# EAGLE design Group_03 (EAGLE 9.6.2)

## Sheet 1 of 2
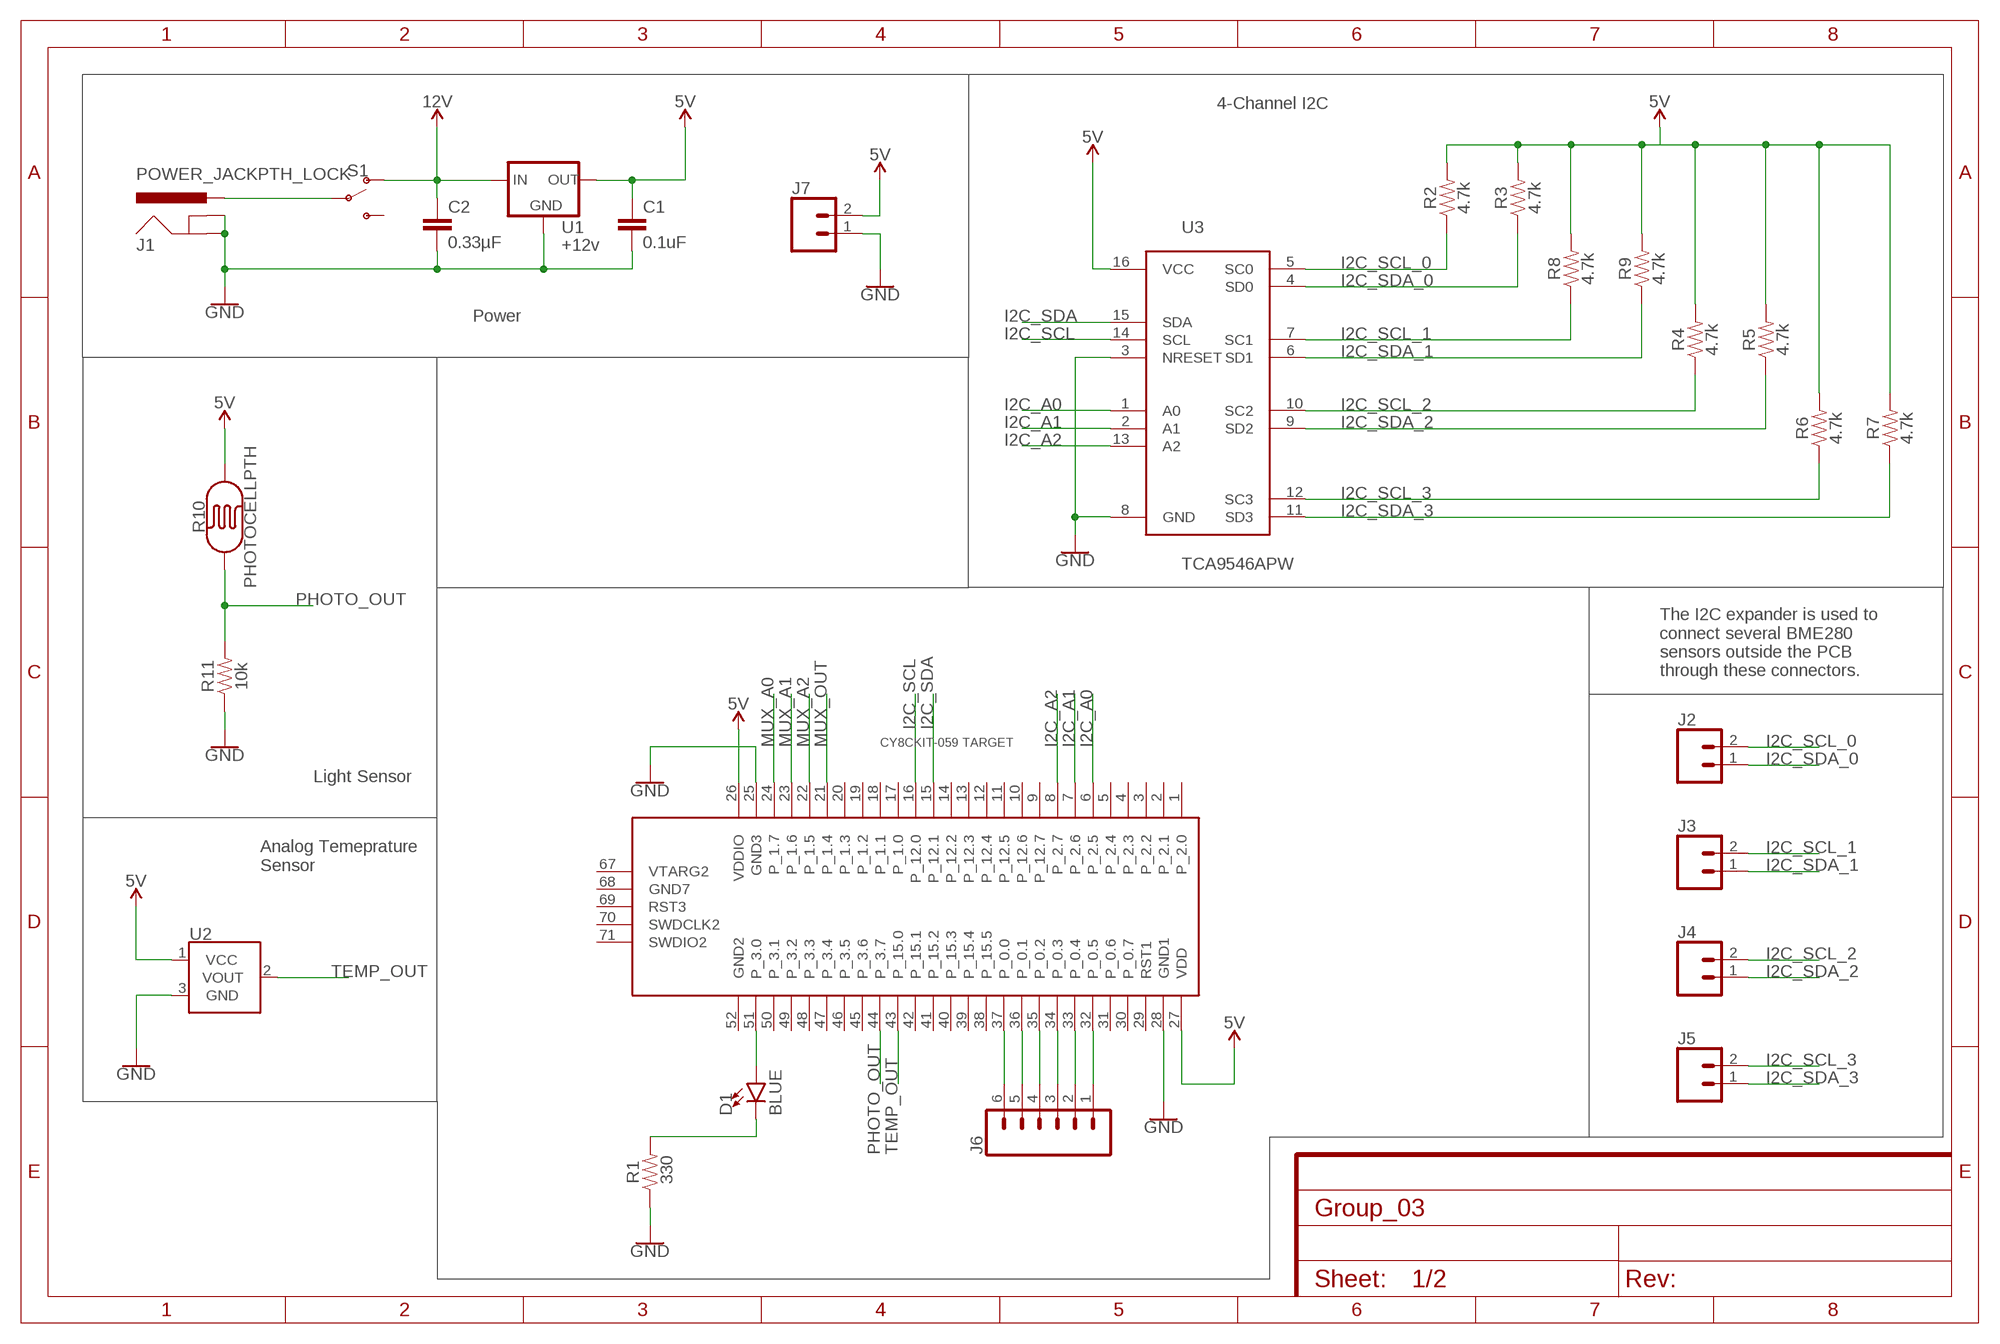
[diagram p0: schematic, sheet 1]

### Parts
C1  0.1uF  0.1UF-KIT-EZ-50V-20%  [CAP-PTH-SMALL-KIT]
C2  0.33µF  0.33UF/330NF-0805-50V-10%  [0805]
D1  BLUE  LED-BLUE1206  [LED-1206]
J1  POWER_JACKPTH_LOCK  [POWER_JACK_PTH_LOCK]
J2  CONN_02  [1X02]
J3  CONN_02  [1X02]
J4  CONN_02  [1X02]
J5  CONN_02  [1X02]
J6  CONN_06LOCK  [1X06_LOCK]
J7  CONN_02  [1X02]
R1  330  RESISTORAXIAL-0.3  [AXIAL-0.3]
R2  4.7k  4.7KOHM-0603-1/10W-1%  [0603]
R3  4.7k  4.7KOHM-0603-1/10W-1%  [0603]
R4  4.7k  4.7KOHM-0603-1/10W-1%  [0603]
R5  4.7k  4.7KOHM-0603-1/10W-1%  [0603]
R6  4.7k  4.7KOHM-0603-1/10W-1%  [0603]
R7  4.7k  4.7KOHM-0603-1/10W-1%  [0603]
R8  4.7k  4.7KOHM-0603-1/10W-1%  [0603]
R9  4.7k  4.7KOHM-0603-1/10W-1%  [0603]
R10  PHOTOCELLPTH  [PHOTOCELL]
R11  10k  10KOHM-0603-1/10W-1%  [0603]
S1  SWITCH-SPDT-PTH-11.6X4.0MM  [SWITCH_SPDT_PTH_11.6X4.0MM]
U1  +12v  V_REG_78XX7812  [TO-252]
U2  TMP36GT9  [TO-92]
U3  TCA9546APW  [TSSOP16]
U$1  CY8CKIT-059_TARGET  [CY8CKIT-059_TARGET]

### Nets
5V: C1.1 J7.2 R2.2 R3.2 R4.2 R5.2 R6.2 R7.2 R8.2 R9.2 R10.2 U1.2(OUT) U2.1(VCC) U3.16(VCC) U$1.26(VDDIO) U$1.27(VDD) ; also sheet 2
12V: C2.1 S1.1(O) U1.1(IN)
GND: C1.2 C2.2 J1.GND J1.GNDBREAK J7.1 R1.P$1 R11.1 U1.3(GND) U2.3(GND) U3.3(NRESET) U3.8(GND) U$1.25(GND3) U$1.28(GND1) ; also sheet 2
I2C_A0: U3.1(A0) U$1.6(P_2.5)
I2C_A1: U3.2(A1) U$1.7(P_2.6)
I2C_A2: U3.13(A2) U$1.8(P_2.7)
I2C_SCL: U3.14(SCL) U$1.16(P_12.0)
I2C_SCL_0: J2.2 R2.1 U3.5(SC0)
I2C_SCL_1: J3.2 R8.1 U3.7(SC1)
I2C_SCL_2: J4.2 R4.1 U3.10(SC2)
I2C_SCL_3: J5.2 R6.1 U3.12(SC3)
I2C_SDA: U3.15(SDA) U$1.15(P_12.1)
I2C_SDA_0: J2.1 R3.1 U3.4(SD0)
I2C_SDA_1: J3.1 R9.1 U3.6(SD1)
I2C_SDA_2: J4.1 R5.1 U3.9(SD2)
I2C_SDA_3: J5.1 R7.1 U3.11(SD3)
MUX_A0: U$1.24(P_1.7) ; also sheet 2
MUX_A1: U$1.23(P_1.6) ; also sheet 2
MUX_A2: U$1.22(P_1.5) ; also sheet 2
MUX_OUT: U$1.21(P_1.4) ; also sheet 2
N$1: J1.PWR S1.2(P)
N$3: J6.1 U$1.32(P_0.5)
N$4: J6.2 U$1.33(P_0.4)
N$5: J6.3 U$1.34(P_0.3)
N$6: J6.4 U$1.35(P_0.2)
N$7: J6.5 U$1.36(P_0.1)
N$8: J6.6 U$1.37(P_0.0)
N$9: D1.A U$1.51(P_3.0)
N$11: D1.C R1.P$2
PHOTO_OUT: R10.1 R11.2 U$1.44(P_3.7)
TEMP_OUT: U2.2(VOUT) U$1.43(P_15.0)
Unconnected: S1.3(S) U$1.1(P_2.0) U$1.2(P_2.1) U$1.3(P_2.2) U$1.4(P_2.3) U$1.5(P_2.4) U$1.9(P_12.7) U$1.10(P_12.6) U$1.11(P_12.5) U$1.12(P_12.4) U$1.13(P_12.3) U$1.14(P_12.2) U$1.17(P_1.0) U$1.18(P_1.1) U$1.19(P_1.2) U$1.20(P_1.3) U$1.29(RST1) U$1.30(P_0.7) U$1.31(P_0.6) U$1.38(P_15.5) U$1.39(P_15.4) U$1.40(P_15.3) U$1.41(P_15.2) U$1.42(P_15.1) U$1.45(P_3.6) U$1.46(P_3.5) U$1.47(P_3.4) U$1.48(P_3.3) U$1.49(P_3.2) U$1.50(P_3.1) U$1.52(GND2) U$1.67(VTARG2) U$1.68(GND7) U$1.69(RST3) U$1.70(SWDCLK2) U$1.71(SWDIO2)

### Notes on the sheet
- 4-Channel I2C
- Power
- The I2C expander is used to
  connect several BME280
  sensors outside the PCB
  through these connectors.
- Light Sensor
- Analog Temeprature 
  Sensor

## Sheet 2 of 2
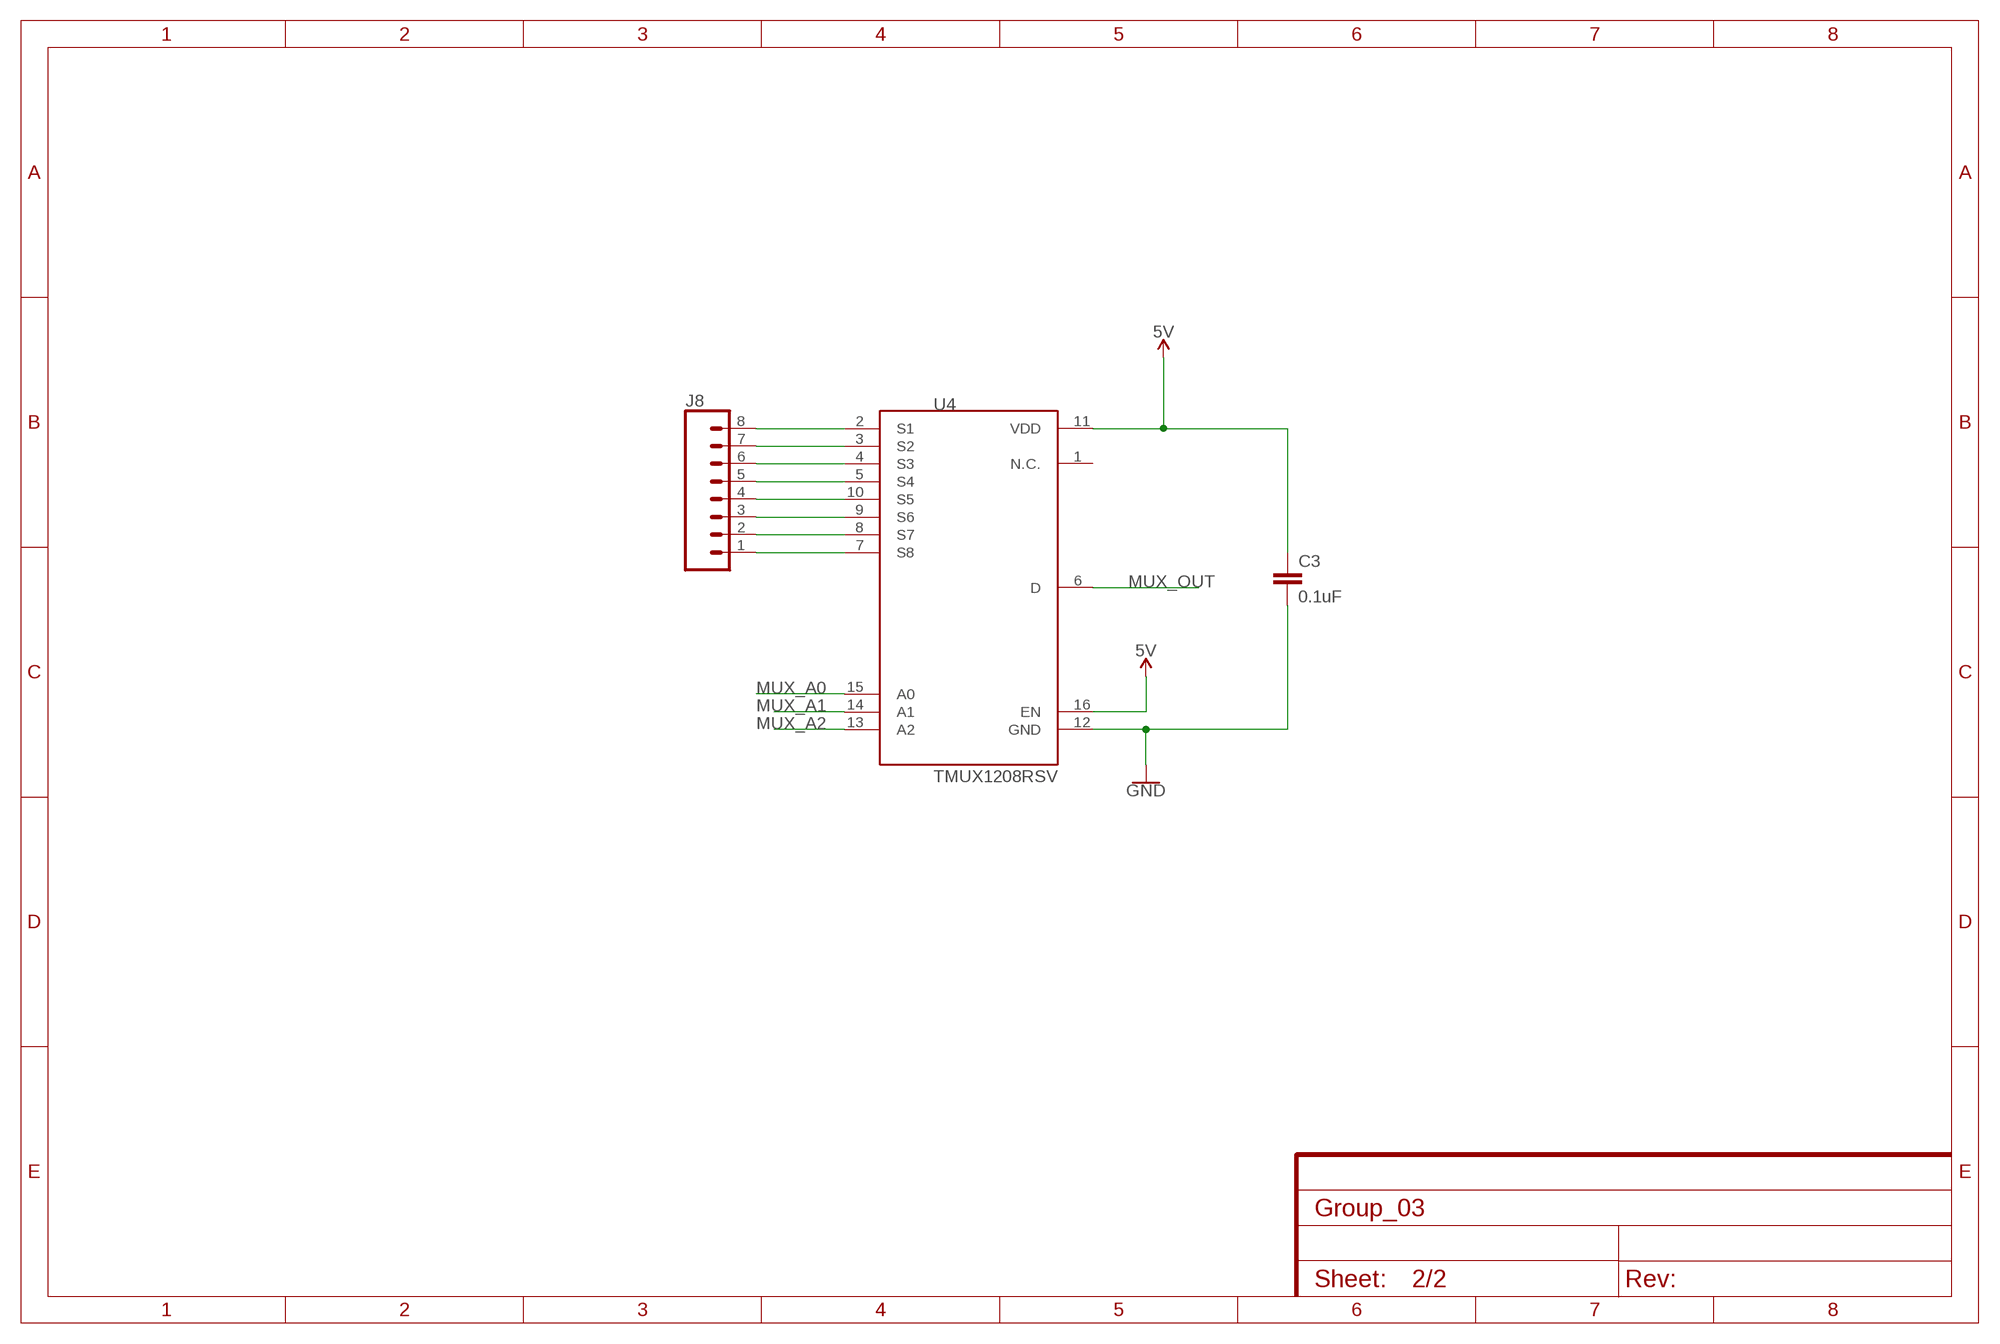
[diagram p1: schematic, sheet 2]

### Parts
C3  0.1uF  0.1UF-KIT-EZ-50V-20%  [CAP-PTH-SMALL-KIT]
J8  CONN_08LOCK  [1X08_LOCK]
U4  TMUX1208RSV  [QFN16]

### Nets
5V: C3.1 U4.11(VDD) U4.16(EN) ; also sheet 1
GND: C3.2 U4.12(GND) ; also sheet 1
MUX_A0: U4.15(A0) ; also sheet 1
MUX_A1: U4.14(A1) ; also sheet 1
MUX_A2: U4.13(A2) ; also sheet 1
MUX_OUT: U4.6(D) ; also sheet 1
N$2: J8.8 U4.2(S1)
N$12: J8.7 U4.3(S2)
N$13: J8.6 U4.4(S3)
N$14: J8.5 U4.5(S4)
N$15: J8.4 U4.10(S5)
N$16: J8.3 U4.9(S6)
N$17: J8.2 U4.8(S7)
N$18: J8.1 U4.7(S8)
Unconnected: U4.1(N.C.)

## Library data of the parts
C1 C3 = SparkFun-Capacitors:0.1UF: 0.1µF ceramic capacitors A capacitor is a passive two-terminal electrical component used to store electrical energy temporarily in an electric field.; PROD_ID: CAP-08370
C2 = SparkFun-Capacitors:0.33UF/330NF: 0.33µF/330nF ceramic capacitors A capacitor is a passive two-terminal electrical component used to store electrical energy temporarily in an electric field.; PROD_ID: CAP-08469
D1 = SparkFun-LED:LED-BLUE: Blue SMD LED Used in manufacturing of various products at SparkFun Packages: 0603 - SMD 0603 package [Product Link] <http://www.digikey.com/product-detail/en/SMLE12BC7TT86/511-1589-2-ND/1641808> 1206 - SMD1206 package [Product Link] <http://www.digikey.com/product-detail/en/lite-on-inc/LTST-C150TBKT/160-1643-1-ND/573584> SparkFun Products: ESP8266 Thing-Dev Board <https://www.sparkfun.com/products/13711> RedBoard <https://www.sparkfun.com/products/12757>; PROD_ID: DIO-09911
J1 = SparkFun-Connectors:POWER_JACK: Power Jack Connector This is the standard 5.5mm barrel jack for power. The PTH is the most common, proven, reliable, footprint. The Slot footprint only works if the mill layer is transmitted to the PCB fab house so be warned. Here are the connectors we sell at SparkFun: DC Barrel Power Jack/Connector <https://www.sparkfun.com/products/119> (PRT-00119) DC Barrel Power Jack/Connector (SMD) <https://www.sparkfun.com/products/12748> (PRT-12748) DC Barrel Jack Adapter - Breadboard Compatible <https://www.sparkfun.com/products/10811> (PRT-10811) It is used on this SparkFun product (and many, many others): SparkFun RedBoard - Programmed with Arduino <https://www.sparkfun.com/products/12757> (DEV-12757) Also, if you need a mating power supply or connector, please check these out: Wall Adapter Power Supply - 9VDC 650mA <https://www.sparkfun.com/products/298> (TOL-00298) DC Barrel Jack Adapter - Male <https://www.sparkfun.com/products/10287> (PRT-10287); PROD_ID: CONN-08197; SF_ID: PRT-00119
J2-J5 J7 = SparkFun-Connectors:CONN_02: Multi connection point. Often used as Generic Header-pin footprint for 0.1 inch spaced/style header connections On any of the 0.1 inch spaced packages, you can populate with these: Break Away Headers - Straight <https://www.sparkfun.com/products/116> (PRT-00116) Break Away Male Headers - Right Angle <https://www.sparkfun.com/products/553> (PRT-00553) Female Headers <https://www.sparkfun.com/products/115> (PRT-00115) Break Away Headers - Machine Pin <https://www.sparkfun.com/products/117> (PRT-00117) Break Away Female Headers - Swiss Machine Pin <https://www.sparkfun.com/products/743> (PRT-00743) For SCREWTERMINALS and SPRING TERMINALS visit here: Screw Terimnals on SparkFun.com <https://www.sparkfun.com/search/results?term=Screw+Terminals> (5mm/3.5mm/2.54mm spacing) This device is also useful as a general connection point to wire up your design to another part of your project. Our various solder wires solder well into these plated through hole pads. Hook-Up Wire - Assortment (Stranded, 22 AWG) <https://www.sparkfun.com/products/11375> (PRT-11375) Hook-Up Wire - Assortment (Solid Core, 22 AWG) <https://www.sparkfun.com/products/11367> (PRT-11367) View the entire wire category on our website here <https://www.sparkfun.com/categories/141> Special notes: Molex polarized connector foot print use with: PRT-08233 with associated crimp pins and housings. 2.54_SCREWTERM for use with PRT-10571. 3.5mm Screw Terminal footprints for PRT-08084 5mm Screw Terminal footprints for use with PRT-08432
J6 = SparkFun-Connectors:CONN_06: Multi connection point. Often used as Generic Header-pin footprint for 0.1 inch spaced/style header connections On any of the 0.1 inch spaced packages, you can populate with these: Break Away Headers - Straight <https://www.sparkfun.com/products/116> (PRT-00116) Break Away Male Headers - Right Angle <https://www.sparkfun.com/products/553> (PRT-00553) Female Headers <https://www.sparkfun.com/products/115> (PRT-00115) Break Away Headers - Machine Pin <https://www.sparkfun.com/products/117> (PRT-00117) Break Away Female Headers - Swiss Machine Pin <https://www.sparkfun.com/products/743> (PRT-00743) Arduino Stackable Header - 6 Pin <https://www.sparkfun.com/products/9280> (PRT-09280) For SCREWTERMINALS and SPRING TERMINALS visit here: Screw Terimnals on SparkFun.com <https://www.sparkfun.com/search/results?term=Screw+Terminals> (5mm/3.5mm/2.54mm spacing) This device is also useful as a general connection point to wire up your design to another part of your project. Our various solder wires solder well into these plated through hole pads. Hook-Up Wire - Assortment (Stranded, 22 AWG) <https://www.sparkfun.com/products/11375> (PRT-11375) Hook-Up Wire - Assortment (Solid Core, 22 AWG) <https://www.sparkfun.com/products/11367> (PRT-11367) View the entire wire category on our website here <https://www.sparkfun.com/categories/141>
J8 = SparkFun-Connectors:CONN_08: Multi connection point. Often used as Generic Header-pin footprint for 0.1 inch spaced/style header connections On any of the 0.1 inch spaced packages, you can populate with these: Break Away Headers - Straight <https://www.sparkfun.com/products/116> (PRT-00116) Break Away Male Headers - Right Angle <https://www.sparkfun.com/products/553> (PRT-00553) Female Headers <https://www.sparkfun.com/products/115> (PRT-00115) Break Away Headers - Machine Pin <https://www.sparkfun.com/products/117> (PRT-00117) Break Away Female Headers - Swiss Machine Pin <https://www.sparkfun.com/products/743> (PRT-00743) Arduino Stackable Header - 8 Pin <https://www.sparkfun.com/products/9279> (PRT-09279) For SCREWTERMINALS and SPRING TERMINALS visit here: Screw Terimnals on SparkFun.com <https://www.sparkfun.com/search/results?term=Screw+Terminals> (5mm/3.5mm/2.54mm spacing) This device is also useful as a general connection point to wire up your design to another part of your project. Our various solder wires solder well into these plated through hole pads. Hook-Up Wire - Assortment (Stranded, 22 AWG) <https://www.sparkfun.com/products/11375> (PRT-11375) Hook-Up Wire - Assortment (Solid Core, 22 AWG) <https://www.sparkfun.com/products/11367> (PRT-11367) View the entire wire category on our website here <https://www.sparkfun.com/categories/141> Special notes: Molex polarized connector foot print use with SKU : PRT-08231 with associated crimp pins and housings. 1MM SMD Version SKU: PRT-10208 NOTES ON THE VARIANTS LOCK and LOCK_LONGPADS... This footprint was designed to help hold the alignment of a through-hole component (i.e. 6-pin header) while soldering it into place. You may notice that each hole has been shifted either up or down by 0.005 of an inch from it's more standard position (which is a perfectly straight line). This slight alteration caused the pins (the squares in the middle) to touch the edges of the holes. Because they are alternating, it causes a "brace" to hold the component in place. 0.005 has proven to be the perfect amount of "off-center" position when using our standard breakaway headers. Although looks a little odd when you look at the bare footprint, once you have a header in there, the alteration is very hard to notice. Also,if you push a header all the way into place, it is covered up entirely on the bottom side.
R1 = SparkFun-Resistors:RESISTOR: Generic Resistor Package
R2-R9 = SparkFun-Resistors:4.7KOHM: 4.7kΩ resistor A resistor is a passive two-terminal electrical component that implements electrical resistance as a circuit element. Resistors act to reduce current flow, and, at the same time, act to lower voltage levels within circuits. - Wikipedia; PROD_ID: RES-07857
R10 = SparkFun-Sensors:PHOTOCELL: Photocell (Photodetector, Photo Resistor, CdS) This is a very small light sensor. A photocell changes (also called a photodetector, photo resistor, CdS or photoconductive cell) resistance depending on the amount of light it is exposed to. These little sensors make great ambient light triggers (when light in the room turns on, do something). Datasheet <http://cdn.sparkfun.com/datasheets/Sensors/LightImaging/SEN-09088.pdf> SparkFun Products Mini Photocell <https://www.sparkfun.com/products/9088> (SEN-09088); PROD_ID: COMP-09129; SF_ID: SEN-09088
R11 = SparkFun-Resistors:10KOHM: 10kΩ resistor A resistor is a passive two-terminal electrical component that implements electrical resistance as a circuit element. Resistors act to reduce current flow, and, at the same time, act to lower voltage levels within circuits. - Wikipedia; PROD_ID: RES-00824
S1 = SparkFun-Switches:SWITCH-SPDT: Single Pole, Double Throw (SPDT) Switch Single-pole, double-throw (SPDT) switch. Variant Overview SMD-AYZ0202 Surface Mount DPDT Switch <https://www.sparkfun.com/products/597> (COM-00597) Used on e.g. LilyPad Arduino USB - ATmega32U4 Board <https://www.sparkfun.com/products/12049> PTH-11.6X4.0MM SPDT Mini Power Switch <https://www.sparkfun.com/products/102> (COM-00102) Used on e.g. SparkFun Simon Says - Through-Hole Soldering Kit <https://www.sparkfun.com/products/10547> (KIT-10547) PTH-11.6X4.0MM-KIT KIT version of SPDT Mini Power Switch - Simplifies soldering by removing tStop of switch pins - only one side can be soldered. PTH-11.6X4.0MM-LOCK LOCK version of SPDT Mini Power Switch - Offset pins hold switch in place for easier soldering. SMD-RIGHT-ANGLE Surface Mount Right Angle Switch <https://www.sparkfun.com/products/10860> (COM-10860) Used on e.g. SparkFun ESP8266 Thing <https://www.sparkfun.com/products/13231>; PROD_ID: SWCH-08261; SF_SKU: COM-00102
U1 = SparkFun-IC-Power:V_REG_78XX: Voltage Regulator Standard 78xx regulator. IGO (Input Ground Output). Spark Fun Electronics SKU : COM-00107; PROD_ID: VREG-12370
U2 = SparkFun-Sensors:TMP36: TMP36 Precision Analog °C Temperature Sensor The TMP36 is a low voltage, precision centigrade temperature sensor. It provides a voltage output that is linearly proportional to the Celsius temperature. It also doesn’t require any external calibration to provide typical accuracies of ±1°C at +25°C and ±2°C over the −40°C to +125°C temperature range. We like it because it’s so easy to use: Just give the device a ground and 2.7 to 5.5 VDC and read the voltage on the Vout pin. The output voltage can be converted to temperature easily using the scale factor of 10 mV/°C. Datasheet <http://cdn.sparkfun.com/datasheets/Sensors/Temp/TMP35_36_37.pdf> SparkFun Products Temperature Sensor - TMP36 <https://www.sparkfun.com/products/10988> (SEN-10988) SparkFun Danger Shield <https://www.sparkfun.com/products/11649> (DEV-11649); PROD_ID: IC-09880; SF_ID: SEN-10988
U3 = Group_03_Library:TCA9546A: TCA9546A The TCA9546A is a quad bidirectional translating switch controlled via the I 2C bus. The SCL/SDA upstream pair fans out to four downstream pairs, or channels. Any individual SCn/SDn channel or combination of channels can be selected, determined by the contents of the programmable control register Available packages: TSSOP SOIC
U4 = Group_03_Library:TMUX1208: The TMUX1208 and TMUX1209 are general purpose complementary metal-oxide semiconductor (CMOS) multiplexers (MUX). The TMUX1208 offers 8:1 singleended channels, while the TMUX1209 offers differential 4:1 or dual 4:1 single-ended channels. Wide operating supply of 1.08 V to 5.5 V allows for use in a broad array of applications from personal electronics to building automation applications. The device supports bidirectional analog and digital signals on the source (Sx) and drain (D) pins ranging from GND to VDD. All logic inputs have 1.8 V logic compatible thresholds, ensuring both TTL and CMOS logic compatibility when operating in the valid supply voltage range. Fail-Safe Logic circuitry allows voltages on the control pins to be applied before the supply pin, protecting the device from potential damage
U$1 = Group_03_Library:CY8CKIT-059_TARGET: CY8CKIT-059 Target This device exposes the pins of the target section of the CY8CKIT-059, including the programming section, that must be connected to the KitProg in order to program the target micro-controller.

## Board
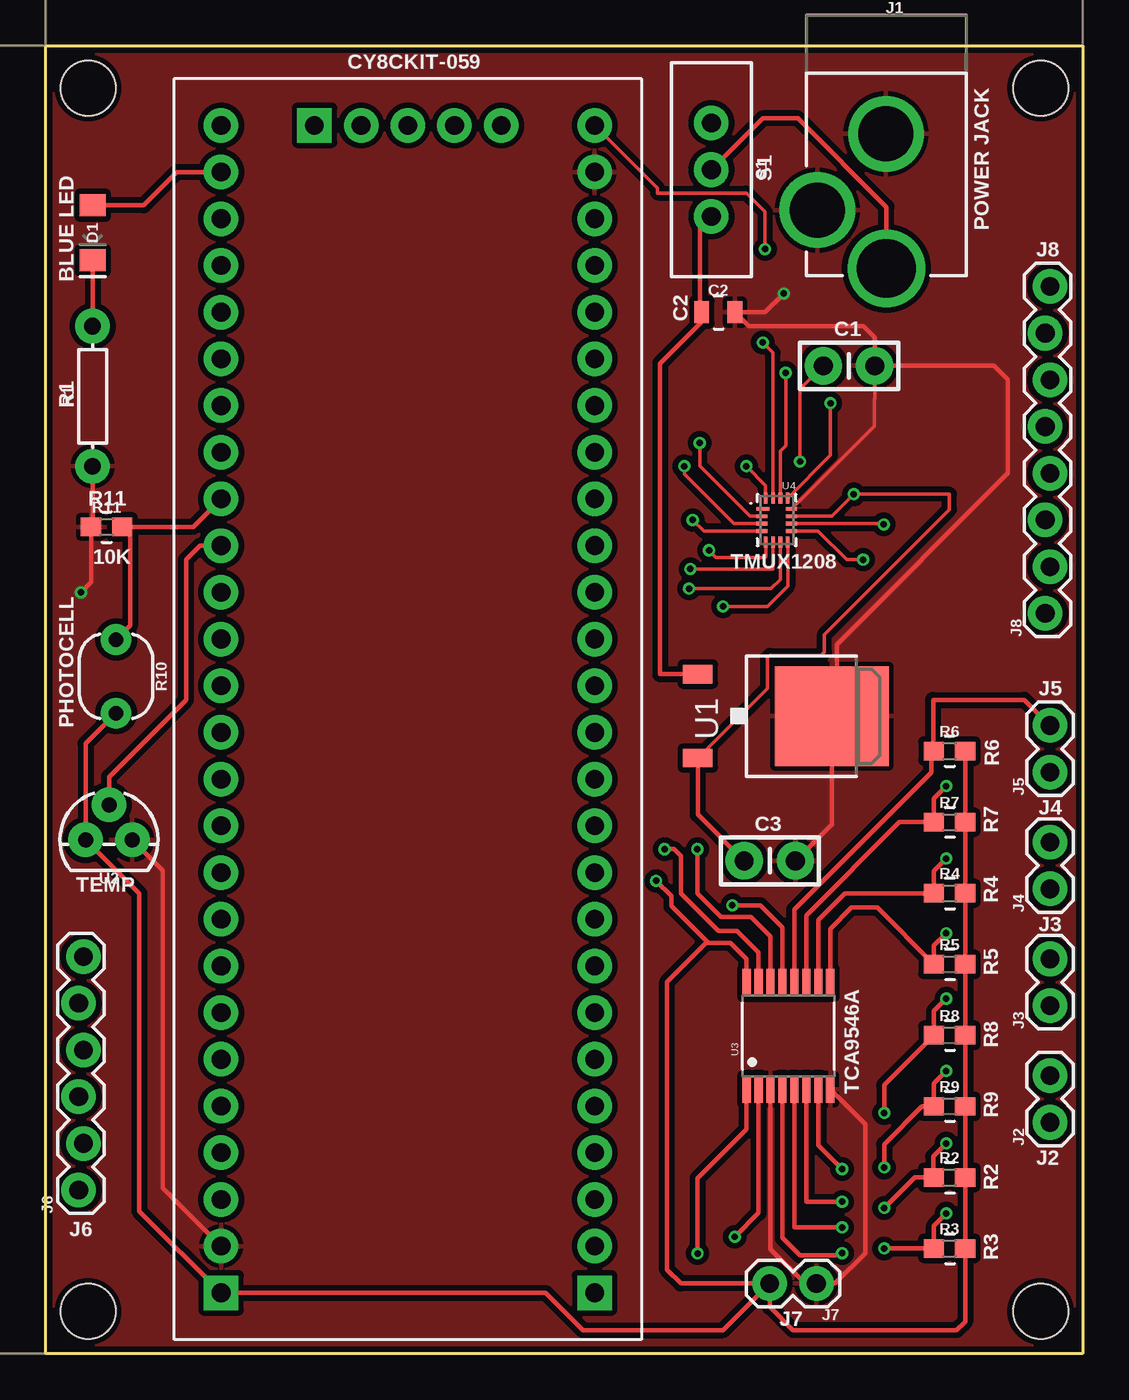
[diagram p2: board, top side]
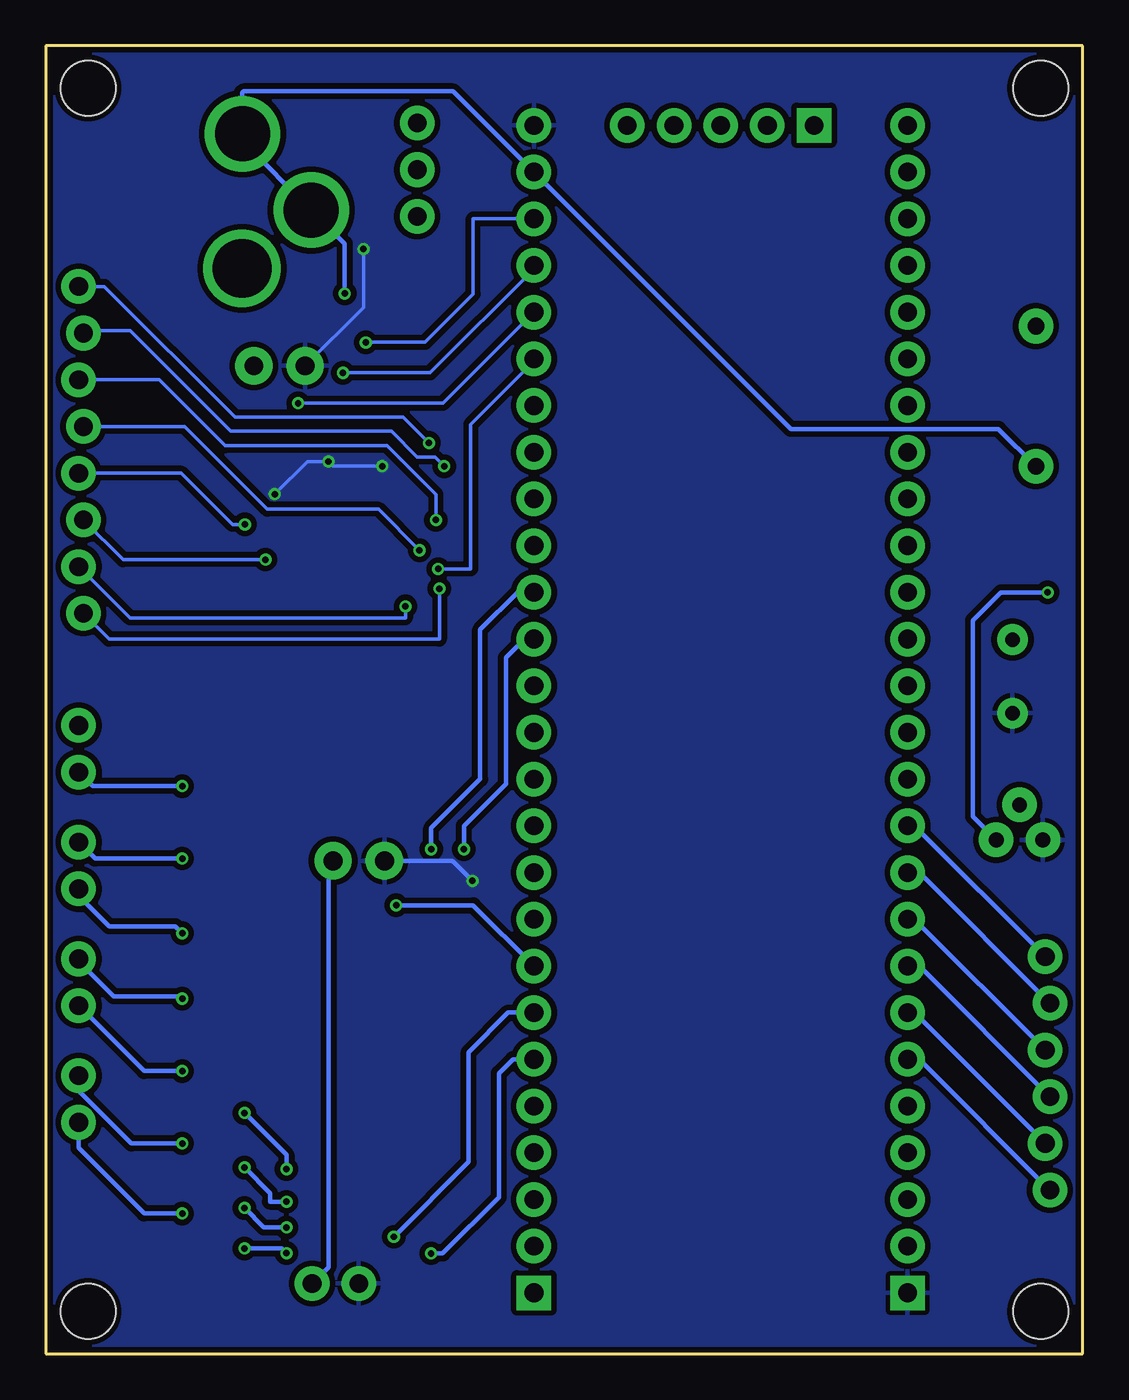
[diagram p3: board, bottom side, seen from below]

Size 56.39 x 71.12 mm. Coordinates in mm from the lower left corner, seen from the top.
Outline: 56.39,71.12 56.39,0 0,0 0,71.12 56.39,71.12
Copper layers (1*16): Top 0.035mm / dielectric 1.5mm / Bottom 0.035mm
Design rules "Group_03": minimum track width 6mil, minimum drill 0.2mm, track to track 6mil, track to pad 6mil, pad to pad 6mil, via to via 6mil, smd to smd 6mil, copper to edge 8mil, drill to drill 20mil, minimum pad ring 10mil, minimum via ring 6mil, stop-mask expansion 8mil, vias tented up to drill 0mil, thermal gap 10mil
Holes 3 mm at 54.1,2.29 54.1,68.83 2.29,2.29 2.29,68.83

### Footprints (pad centres in the part's own frame; a part is rotated, then mirrored left to right if it is on the bottom)
CAP-PTH-SMALL-KIT = drill 1.016 pad 2.032: 1 -1.397,0; 2 1.397,0
0805 = smd 0.8 x 1.2: 1 -0.9,0; 2 0.9,0
LED-1206 = smd 1.2 x 1.4: A -1.5,0; C 1.5,0
POWER_JACK_PTH_LOCK = drill 2.997 pad 4.115: GND 0.025,6.557; GNDBREAK 3.762,10.7 | drill 3.2 pad 4.115: PWR 0,13.878
1X02 = drill 1.016 pad 1.88: 1 0,0; 2 2.54,0
1X06_LOCK = drill 1.016 pad 1.88: 1 0,0; 2 2.54,-0.254; 3 5.08,0; 4 7.62,-0.254; 5 10.16,0; 6 12.7,-0.254
1X08_LOCK = drill 1.016 pad 1.88: 1 0,0.127; 2 2.54,-0.127; 3 5.08,0.127; 4 7.62,-0.127; 5 10.16,0.127; 6 12.7,-0.127; 7 15.24,0.127; 8 17.78,-0.127
AXIAL-0.3 = drill 0.9 pad 1.88: P$1 -3.81,0; P$2 3.81,0
0603 = smd 1.1 x 1: 1 -0.85,0; 2 0.85,0
PHOTOCELL = drill 0.8 pad 1.676: 1 -2,0; 2 2,0
SWITCH_SPDT_PTH_11.6X4.0MM = drill 1.016 pad 1.88: 1 0,2.54; 2 0,0; 3 0,-2.54
TO-252 = smd 1 x 1.6: 1 -2.28,-4.8; 2 2.28,-4.8 | smd 5.4 x 6.2: 3 0,2.5
TO-92 = drill 0.813 pad 1.88: 1 -1.27,0; 2 0,1.905; 3 1.27,0
TSSOP16 = smd 1.5 x 0.45: 1 -2.9,2.275; 2 -2.9,1.625; 3 -2.9,0.975; 4 -2.9,0.325; 5 -2.9,-0.325; 6 -2.9,-0.975; 7 -2.9,-1.625; 8 -2.9,-2.275; 9 2.9,-2.275; 10 2.9,-1.625; 11 2.9,-0.975; 12 2.9,-0.325; 13 2.9,0.325; 14 2.9,0.975; 15 2.9,1.625; 16 2.9,2.275
QFN16 = smd 0.7 x 0.2: 1 -0.75,0.6 | smd 0.6 x 0.2: 2 -0.8,0.2; 3 -0.8,-0.2; 4 -0.8,-0.6; 9 0.8,-0.6; 10 0.8,-0.2; 11 0.8,0.2; 12 0.8,0.6 | smd 0.2 x 0.6: 5 -0.6,-1.2; 6 -0.2,-1.2; 7 0.2,-1.2; 8 0.6,-1.2; 13 0.6,1.2; 14 0.2,1.2; 15 -0.2,1.2; 16 -0.6,1.2
CY8CKIT-059_TARGET = drill 1.016 pad 1.876 square: 1 30.48,8.89; 27 30.48,-11.43; 71 -33.02,-6.35 | drill 1.016 pad 1.876: 2 27.94,8.89; 3 25.4,8.89; 4 22.86,8.89; 5 20.32,8.89; 6 17.78,8.89; 7 15.24,8.89; 8 12.7,8.89; 9 10.16,8.89; 10 7.62,8.89; 11 5.08,8.89; 12 2.54,8.89; 13 0,8.89; 14 -2.54,8.89; 15 -5.08,8.89; 16 -7.62,8.89; 17 -10.16,8.89; 18 -12.7,8.89; 19 -15.24,8.89; 20 -17.78,8.89; 21 -20.32,8.89; 22 -22.86,8.89; 23 -25.4,8.89; 24 -27.94,8.89; 25 -30.48,8.89; 26 -33.02,8.89; 28 27.94,-11.43; 29 25.4,-11.43; 30 22.86,-11.43; 31 20.32,-11.43; 32 17.78,-11.43; 33 15.24,-11.43; 34 12.7,-11.43; 35 10.16,-11.43; 36 7.62,-11.43; 37 5.08,-11.43; 38 2.54,-11.43; 39 0,-11.43; 40 -2.54,-11.43; 41 -5.08,-11.43; 42 -7.62,-11.43; 43 -10.16,-11.43; 44 -12.7,-11.43; 45 -15.24,-11.43; 46 -17.78,-11.43; 47 -20.32,-11.43; 48 -22.86,-11.43; 49 -25.4,-11.43; 50 -27.94,-11.43; 51 -30.48,-11.43; 52 -33.02,-11.43; 67 -33.02,3.81; 68 -33.02,1.27; 69 -33.02,-1.27; 70 -33.02,-3.81

### Placement (x,y rotation side)
C1  43.69,53.72 0 top
C2  36.58,56.64 0 top
C3  39.37,26.8 0 top
D1  2.54,60.96 270 top
J1  45.72,72.9 180 top
J2  54.61,12.57 90 top
J3  54.61,18.92 90 top
J4  54.61,25.27 90 top
J5  54.61,31.62 90 top
J6  1.78,8.89 90 top
J7  41.91,3.81 180 top
J8  54.48,40.26 90 top
R1  2.54,52.07 90 top
R2  49.15,9.58 0 top
R3  49.15,5.71 0 top
R4  49.15,25.04 0 top
R5  49.15,21.17 0 top
R6  49.15,32.77 0 top
R7  49.15,28.9 0 top
R8  49.15,17.31 0 top
R9  49.15,13.44 0 top
R10  3.81,36.83 270 top
R11  3.3,44.96 0 top
S1  36.2,64.39 180 top
U1  40.26,34.67 270 top
U2  3.43,27.94 0 top
U3  40.39,17.27 90 top
U4  39.75,45.34 0 top
U$1  20.95,33.78 270 top

### Tracks (layer width: path | path; a pad name or v marks a point on that pad's centre or on a via)
5V  (via drill 0.35)
  Top 0.203: U$1.26 33.27,63.37 33.27,63.12 38.1,63.12 39.12,62.1 v39.12,60.07 | C1.1 41.02,52.45 v41.02,48.51 | v38.1,48.26 39.15,47.22 U4.16 | U4.11 42.74,45.54 v43.94,46.74 49.15,46.74 49.15,45.91 42.35,39.12 42.35,38.16 42.16,37.97 39.37,37.97 39.24,37.85 39.24,36.17 U1.2
  Top 0.254: R10.2 2.16,33.18 U2.1 5.08,25.02 5.08,7.75 U$1.27 27.18,3.3 29.21,1.27 36.83,1.27 J7.2 | U3.16 38.11,21.45 37.24,22.33 36.03,22.33 | 36.03,22.33 35.9,22.33 33.78,20.21 33.78,4.57 34.54,3.81 J7.2 | 36.03,22.33 34.01,24.34 34.01,24.89 v33.19,25.71 | R6.2 R7.2 R4.2 R5.2 R8.2 R9.2 R2.2 R3.2 50,1.74 49.53,1.27 40.64,1.27 39.37,2.54 J7.2 | U1.2 35.46,29.31 C3.1
  Bottom 0.203: C1.1 39.12,56.9 v39.12,60.07 | v38.1,48.26 40.77,48.26 v41.02,48.51 42.16,48.51 v43.94,46.74
  Bottom 0.254: v33.19,25.71 34.28,26.8 C3.1
  pour Bottom (isolate 0.305): 0,0 56.39,0 56.39,71.12 0,71.12
12V
  Top 0.254: S1.1 35.56,61.21 35.56,56.76 C2.1 35.68,56.12 33.4,53.85 33.4,36.95 U1.1
GND  (via drill 0.35)
  Top 0.203: U4.12 45.05,50.44 45.05,51.91 45.09,51.94 C1.2
  Top 0.254: R1.P$1 2.54,45.18 R11.1 2.45,41.95 v1.91,41.4 | U2.3 6.35,26.29 6.35,9.02 U$1.28 | v40.13,57.66 39.12,56.64 C2.2 38.24,55.88 44.45,55.88 45.09,55.24 C1.2 51.56,53.72 52.32,52.96 52.32,47.88 43.01,38.57 43.01,34.92 U1.3 42.76,28.79 C3.2 | U3.3 39.41,5.67 41.27,3.81 J7.1 42.93,3.81 44.58,5.46 44.58,12.46 U3.8
  Bottom 0.254: v1.91,41.4 4.45,41.4 5.97,39.88 5.97,29.21 U2.3 | R1.P$1 4.57,50.29 15.88,50.29 U$1.25 34.24,68.66 45.64,68.66 45.72,68.58 45.72,66.37 J1.GND 45.7,65.93 J1.GNDBREAK 40.13,60.37 v40.13,57.66 | C3.2 41.02,26.54 41.02,4.7 J7.1
  pour Top (isolate 0.305): 0,0 56.39,0 56.39,71.12 0,71.12
I2C_A0  (via drill 0.35)
  Top 0.254: U3.1 38.11,12.2 35.44,9.53 v35.44,5.45
  Bottom 0.254: v35.44,5.45 34.81,5.45 31.75,8.51 31.75,15.24 30.99,16 U$1.6
I2C_A1  (via drill 0.35)
  Top 0.254: U3.2 38.76,7.65 v37.47,6.35
  Bottom 0.254: v37.47,6.35 33.4,10.41 33.4,16.38 31.24,18.54 U$1.7
I2C_A2  (via drill 0.35)
  Top 0.254: U3.13 40.06,23.18 38.86,24.38 v37.34,24.38
  Bottom 0.254: v37.34,24.38 33.15,24.38 U$1.8
I2C_SCL  (via drill 0.35)
  Top 0.254: v35.43,27.43 35.43,25.02 36.7,23.75 38.35,23.75 39.41,22.69 U3.14
  Bottom 0.254: v35.43,27.43 35.43,28.57 32.77,31.24 32.77,39.37 30.73,41.4 U$1.16
I2C_SCL_0  (via drill 0.35)
  Top 0.254: U3.5 40.71,6.86 v43.31,6.86 | v48.97,11.43 48.26,10.72 48.26,9.62 R2.1 47.26,9.58 v45.59,7.92
  Bottom 0.254: v48.97,11.43 51.74,11.43 54.61,14.3 J2.2 | v45.59,7.92 44.53,6.86 v43.31,6.86
I2C_SCL_1  (via drill 0.35)
  Top 0.254: U3.7 42.01,11.33 v43.31,10.03 | v48.97,19.3 48.3,18.63 R8.1 45.59,14.6 v45.59,13.08
  Bottom 0.254: v48.97,19.3 49.1,19.43 52.7,19.43 54.61,21.34 J3.2 | v45.59,13.08 43.31,10.79 v43.31,10.03
I2C_SCL_2  (via drill 0.35)
  Top 0.254: U3.10 42.01,23.6 43.45,25.04 R4.1 48.3,26.25 v48.97,26.92
  Bottom 0.254: v48.97,26.92 53.72,26.92 J4.2
I2C_SCL_3
  Top 0.254: U3.12 40.71,24.15 48.16,31.59 48.16,32.62 R6.1 48.26,32.8 48.26,35.56 53.21,35.56 J5.2
I2C_SDA  (via drill 0.35)
  Top 0.254: U3.15 38.76,21.82 37.59,22.99 36.58,22.99 34.54,25.02 34.54,27.05 34.16,27.43 v33.66,27.43
  Bottom 0.254: v33.66,27.43 33.66,28.7 31.37,30.99 31.37,37.85 30.35,38.86 U$1.15
I2C_SDA_0  (via drill 0.35)
  Top 0.254: v48.97,7.62 48.3,6.95 R3.1 v45.59,5.71 | U3.4 40.06,6.29 41.02,5.33 43.18,5.33 v43.31,5.46
  Bottom 0.254: v48.97,7.62 51.05,7.62 54.61,11.18 J2.1 | v45.59,5.71 43.56,5.71 v43.31,5.46
I2C_SDA_1  (via drill 0.35)
  Top 0.254: v48.97,15.37 48.3,14.69 R9.1 47.65,13.44 45.59,11.39 v45.59,10.12 | U3.6 41.36,8.26 v43.31,8.26
  Bottom 0.254: v48.97,15.37 51.05,15.37 J3.1 | v45.59,10.12 44.2,8.72 44.2,8.26 v43.31,8.26
I2C_SDA_2  (via drill 0.35)
  Top 0.254: U3.9 42.66,23.1 43.81,24.26 45.22,24.26 R5.1 48.3,22.18 v48.97,22.86
  Bottom 0.254: v48.97,22.86 49.35,23.24 52.96,23.24 54.61,24.89 J4.1
I2C_SDA_3  (via drill 0.35)
  Top 0.254: U3.11 41.36,23.84 46.42,28.9 R7.1 48.3,30.19 v48.97,30.86
  Bottom 0.254: v48.97,30.86 53.85,30.86 J5.1
MUX_A0  (via drill 0.35)
  Top 0.203: U4.15 39.55,54.43 v38.99,54.99
  Bottom 0.203: U$1.24 33.15,61.72 33.15,57.62 35.76,55.01 38.97,55.01 v38.99,54.99
MUX_A1  (via drill 0.35)
  Top 0.203: U4.14 39.95,49.09 40.24,49.38 v40.24,53.34
  Bottom 0.203: U$1.23 29.84,58.99 35.49,53.34 v40.24,53.34
MUX_A2  (via drill 0.35)
  Top 0.203: U4.13 42.67,48.86 v42.67,51.69
  Bottom 0.203: v42.67,51.69 34.8,51.69 U$1.22
MUX_OUT  (via drill 0.35)
  Top 0.203: U4.6 39.53,44.12 39.53,42.67 v35.05,42.67
  Bottom 0.203: U$1.21 29.84,53.98 33.29,50.53 33.29,42.67 v35.05,42.67
N$1
  Top 0.254: J1.PWR 45.72,62.36 40.89,67.18 38.99,67.18 S1.2
N$2  (via drill 0.35)
  Top 0.203: U4.2 38.28,45.54 35.56,48.26 v35.56,49.53
  Bottom 0.203: v35.56,49.53 36.96,50.93 46.1,50.93 53.21,58.04 J8.8
N$3
  Bottom 0.254: U$1.32 8.89,16 J6.1
N$4
  Bottom 0.254: U$1.33 9.14,18.54 J6.2
N$5
  Bottom 0.254: U$1.34 8.89,21.08 J6.3
N$6
  Bottom 0.254: U$1.35 9.14,23.62 J6.4
N$7
  Bottom 0.254: U$1.36 8.89,26.16 J6.5
N$8
  Bottom 0.254: U$1.37 9.14,28.7 J6.6
N$9
  Top 0.254: U$1.51 7.11,64.26 5.31,62.46 D1.A
N$11
  Top 0.254: D1.C R1.P$2
N$12  (via drill 0.35)
  Top 0.203: U4.3 37.41,45.14 34.72,47.83 v34.72,48.26
  Bottom 0.203: v34.72,48.26 35.23,48.77 36.2,48.77 37.59,50.16 46.35,50.16 51.82,55.63 54.23,55.63 J8.7
N$13  (via drill 0.35)
  Top 0.203: U4.4 35.78,44.74 v35.18,45.34
  Bottom 0.203: v35.18,45.34 35.18,46.72 37.84,49.38 46.65,49.38 50.23,52.96 J8.6
N$14  (via drill 0.35)
  Top 0.203: U4.5 39.15,43.34 39.12,43.31 36.45,43.31 v36.07,43.69
  Bottom 0.203: v36.07,43.69 38.3,45.92 44.35,45.92 48.85,50.42 J8.5
N$15  (via drill 0.35)
  Top 0.203: U4.10 45.52,45.14 v45.57,45.1
  Bottom 0.203: v45.57,45.1 46.24,45.1 49.02,47.88 J8.4
N$16  (via drill 0.35)
  Top 0.203: U4.9 42,44.74 43.56,43.18 v44.45,43.18
  Bottom 0.203: J8.3 52.2,43.18 v44.45,43.18
N$17  (via drill 0.35)
  Top 0.203: U4.8 40.35,41.75 39.24,40.64 v36.83,40.64
  Bottom 0.203: v36.83,40.64 36.83,40.01 51.82,40.01 J8.2
N$18  (via drill 0.35)
  Top 0.203: U4.7 39.95,42.11 39.45,41.61 v34.99,41.61
  Bottom 0.203: v34.99,41.61 34.99,38.86 52.96,38.86 J8.1
PHOTO_OUT
  Top 0.254: U$1.44 8,44.96 R11.2 4.57,44.54 4.57,39.59 R10.1
TEMP_OUT
  Top 0.254: U2.2 3.43,31.37 7.62,35.56 7.62,43.18 8.38,43.94 U$1.43

### Text on the board
tPlace: CY8CKIT-059 | S1 | POWER JACK | J8 | BLUE LED | C2 | C1 | R1 | R11 | 10K | TMUX1208 | J5 | PHOTOCELL | R6 | J4 | C3 | R7 | TEMP | R4 | J3 | R5 | TCA9546A | R8 | R9 | J2 | R2 | J6 | R3 | J7